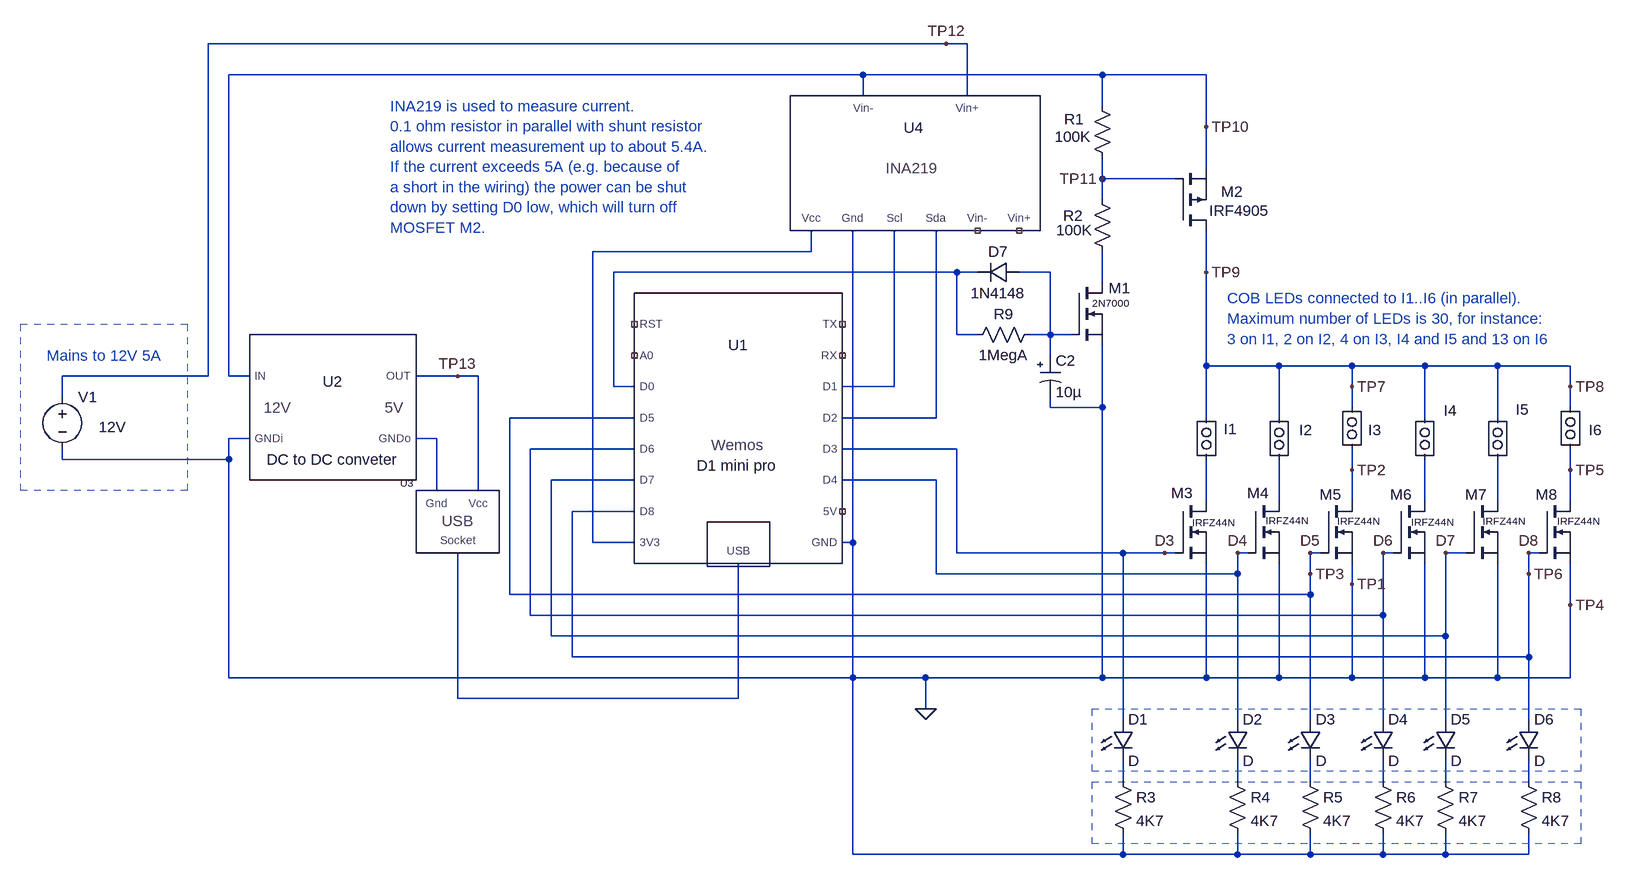
[diagram p0: schematic COBHouseLights.asc]
COBHouseLights.asc, the LTspice schematic file:
Version 4
SHEET 1 2516 680
WIRE 1216 -896 80 -896
WIRE 1248 -896 1216 -896
WIRE 1088 -848 112 -848
WIRE 1456 -848 1088 -848
WIRE 1616 -848 1456 -848
WIRE 1088 -816 1088 -848
WIRE 1248 -816 1248 -896
WIRE 1456 -800 1456 -848
WIRE 1616 -768 1616 -848
WIRE 1616 -704 1616 -768
WIRE 1456 -688 1456 -720
WIRE 1568 -688 1456 -688
WIRE 1456 -656 1456 -688
WIRE 1008 -576 1008 -608
WIRE 1008 -576 672 -576
WIRE 1232 -544 704 -544
WIRE 1264 -544 1232 -544
WIRE 1376 -544 1328 -544
WIRE 1616 -544 1616 -608
WIRE 1456 -528 1456 -576
WIRE 1232 -448 1232 -544
WIRE 1264 -448 1232 -448
WIRE 1376 -448 1376 -544
WIRE 1376 -448 1344 -448
WIRE 1408 -448 1376 -448
WIRE 1376 -416 1376 -448
WIRE 1616 -400 1616 -544
WIRE 1728 -400 1616 -400
WIRE 1840 -400 1728 -400
WIRE 1952 -400 1840 -400
WIRE 2064 -400 1952 -400
WIRE 2176 -400 2064 -400
WIRE 80 -384 80 -896
WIRE 80 -384 -144 -384
WIRE 112 -384 112 -848
WIRE 144 -384 112 -384
WIRE 464 -384 400 -384
WIRE 496 -384 464 -384
WIRE 704 -368 704 -544
WIRE 736 -368 704 -368
WIRE 1136 -368 1136 -608
WIRE 1136 -368 1056 -368
WIRE 1840 -368 1840 -400
WIRE 2176 -368 2176 -400
WIRE -144 -352 -144 -384
WIRE 1376 -336 1376 -352
WIRE 1456 -336 1456 -432
WIRE 1456 -336 1376 -336
WIRE 1840 -336 1840 -368
WIRE 2176 -336 2176 -368
WIRE 736 -320 544 -320
WIRE 1200 -320 1200 -608
WIRE 1200 -320 1056 -320
WIRE 1616 -320 1616 -400
WIRE 1728 -320 1728 -400
WIRE 1952 -320 1952 -400
WIRE 2064 -320 2064 -400
WIRE 144 -288 112 -288
WIRE 432 -288 400 -288
WIRE 736 -272 576 -272
WIRE 1232 -272 1056 -272
WIRE -144 -256 -144 -272
WIRE 112 -256 112 -288
WIRE 112 -256 -144 -256
WIRE 1840 -240 1840 -272
WIRE 2176 -240 2176 -272
WIRE 736 -224 608 -224
WIRE 1200 -224 1056 -224
WIRE 432 -208 432 -288
WIRE 496 -208 496 -384
WIRE 1616 -192 1616 -256
WIRE 1728 -192 1728 -256
WIRE 1840 -192 1840 -240
WIRE 1952 -192 1952 -256
WIRE 2064 -192 2064 -256
WIRE 2176 -192 2176 -240
WIRE 736 -176 640 -176
WIRE 672 -128 672 -576
WIRE 736 -128 672 -128
WIRE 1072 -128 1072 -608
WIRE 1072 -128 1056 -128
WIRE 1232 -112 1232 -272
WIRE 1488 -112 1232 -112
WIRE 1552 -112 1488 -112
WIRE 1568 -112 1552 -112
WIRE 1680 -112 1664 -112
WIRE 1792 -112 1776 -112
WIRE 1904 -112 1888 -112
WIRE 2016 -112 1984 -112
WIRE 2128 -112 2112 -112
WIRE 1200 -80 1200 -224
WIRE 1664 -80 1664 -112
WIRE 1664 -80 1200 -80
WIRE 1776 -80 1776 -112
WIRE 2112 -80 2112 -112
WIRE 1840 -64 1840 -96
WIRE 544 -48 544 -320
WIRE 1776 -48 1776 -80
WIRE 1776 -48 544 -48
WIRE 2176 -32 2176 -96
WIRE 576 -16 576 -272
WIRE 1888 -16 1888 -112
WIRE 1888 -16 576 -16
WIRE 608 16 608 -224
WIRE 1984 16 1984 -112
WIRE 1984 16 608 16
WIRE 640 48 640 -176
WIRE 2112 48 2112 -80
WIRE 2112 48 640 48
WIRE 112 80 112 -256
WIRE 1072 80 1072 -128
WIRE 1072 80 112 80
WIRE 1184 80 1072 80
WIRE 1456 80 1456 -336
WIRE 1456 80 1184 80
WIRE 1616 80 1616 -96
WIRE 1616 80 1456 80
WIRE 1728 80 1728 -96
WIRE 1728 80 1616 80
WIRE 1840 80 1840 -64
WIRE 1840 80 1728 80
WIRE 1952 80 1952 -96
WIRE 1952 80 1840 80
WIRE 2064 80 2064 -96
WIRE 2064 80 1952 80
WIRE 2176 80 2176 -32
WIRE 2176 80 2064 80
WIRE 464 112 464 -112
WIRE 896 112 896 -96
WIRE 896 112 464 112
WIRE 1184 128 1184 80
WIRE 1488 144 1488 -112
WIRE 1664 144 1664 -80
WIRE 1776 144 1776 -48
WIRE 1888 144 1888 -16
WIRE 1984 144 1984 16
WIRE 2112 144 2112 48
WIRE 1488 240 1488 208
WIRE 1664 240 1664 208
WIRE 1776 240 1776 208
WIRE 1888 240 1888 208
WIRE 1984 240 1984 208
WIRE 2112 240 2112 208
WIRE 1072 352 1072 80
WIRE 1488 352 1488 320
WIRE 1488 352 1072 352
WIRE 1664 352 1664 320
WIRE 1664 352 1488 352
WIRE 1776 352 1776 320
WIRE 1776 352 1664 352
WIRE 1888 352 1888 320
WIRE 1888 352 1776 352
WIRE 1984 352 1984 320
WIRE 1984 352 1888 352
WIRE 2112 352 2112 320
WIRE 2112 352 1984 352
FLAG 1552 -112 D3
FLAG 1664 -112 D4
FLAG 1776 -112 D5
FLAG 1888 -112 D6
FLAG 1984 -112 D7
FLAG 2112 -112 D8
FLAG 1840 -64 TP1
FLAG 2176 -32 TP4
FLAG 1840 -240 TP2
FLAG 1616 -544 TP9
FLAG 1616 -768 TP10
FLAG 2176 -240 TP5
FLAG 1776 -80 TP3
FLAG 2112 -80 TP6
FLAG 2176 -368 TP8
FLAG 1840 -368 TP7
FLAG 1456 -688 TP11
FLAG 1216 -896 TP12
FLAG 464 -384 TP13
FLAG 1184 128 0
SYMBOL Custom\\WemosD1-mini-pro 896 -336 R0
WINDOW 3 -2 89 Center 2
SYMATTR InstName U1
SYMBOL Custom\\DC-DC-Converter 272 -336 R0
SYMATTR InstName U2
SYMBOL Custom\\USB 464 -160 M0
SYMATTR InstName U3
SYMBOL voltage -144 -368 R0
WINDOW 3 56 62 Left 2
SYMATTR Value 12V
SYMATTR InstName V1
SYMBOL Custom\\INA219 1168 -736 R0
SYMATTR InstName U4
SYMBOL pmos 1568 -608 M180
WINDOW 0 71 60 Left 2
WINDOW 3 52 31 Left 2
SYMATTR InstName M2
SYMATTR Value IRF4905
SYMBOL nmos 1408 -528 R0
WINDOW 3 32 31 Left 1
WINDOW 0 58 8 Left 2
SYMATTR Value 2N7000
SYMATTR InstName M1
SYMBOL nmos 1568 -192 R0
WINDOW 0 -6 -12 Left 2
WINDOW 3 26 33 Left 1
SYMATTR InstName M3
SYMATTR Value IRFZ44N
SYMBOL nmos 1680 -192 R0
WINDOW 0 -1 -12 Left 2
WINDOW 3 27 30 Left 1
SYMATTR InstName M4
SYMATTR Value IRFZ44N
SYMBOL nmos 1792 -192 R0
WINDOW 0 -2 -10 Left 2
WINDOW 3 25 31 Left 1
SYMATTR InstName M5
SYMATTR Value IRFZ44N
SYMBOL nmos 1904 -192 R0
WINDOW 0 -5 -10 Left 2
WINDOW 3 27 32 Left 1
SYMATTR InstName M6
SYMATTR Value IRFZ44N
SYMBOL res 1440 -816 R0
WINDOW 0 -43 36 Left 2
WINDOW 3 -57 63 Left 2
SYMATTR InstName R1
SYMATTR Value 100K
SYMBOL Custom\\Connector 1600 -320 R0
WINDOW 0 43 17 Left 2
SYMATTR InstName I1
SYMBOL Custom\\Connector 1712 -320 R0
WINDOW 0 47 19 Left 2
SYMATTR InstName I2
SYMBOL Custom\\Connector 1824 -336 R0
WINDOW 0 41 35 Left 2
SYMATTR InstName I3
SYMBOL Custom\\Connector 1936 -320 R0
WINDOW 0 45 -11 Left 2
SYMATTR InstName I4
SYMBOL nmos 2016 -192 R0
WINDOW 0 -2 -10 Left 2
WINDOW 3 25 31 Left 1
SYMATTR InstName M7
SYMATTR Value IRFZ44N
SYMBOL nmos 2128 -192 R0
WINDOW 0 -5 -10 Left 2
WINDOW 3 28 31 Left 1
SYMATTR InstName M8
SYMATTR Value IRFZ44N
SYMBOL Custom\\Connector 2048 -320 R0
WINDOW 0 44 -13 Left 2
SYMATTR InstName I5
SYMBOL Custom\\Connector 2160 -336 R0
WINDOW 0 44 35 Left 2
SYMATTR InstName I6
SYMBOL res 1440 -672 R0
WINDOW 0 -44 41 Left 2
WINDOW 3 -55 63 Left 2
SYMATTR InstName R2
SYMATTR Value 100K
SYMBOL res 1472 224 R0
SYMATTR InstName R3
SYMATTR Value 4K7
SYMBOL LED 1472 144 R0
SYMATTR InstName D1
SYMBOL res 1648 224 R0
SYMATTR InstName R4
SYMATTR Value 4K7
SYMBOL LED 1648 144 R0
SYMATTR InstName D2
SYMBOL res 1760 224 R0
SYMATTR InstName R5
SYMATTR Value 4K7
SYMBOL LED 1760 144 R0
SYMATTR InstName D3
SYMBOL res 1872 224 R0
SYMATTR InstName R6
SYMATTR Value 4K7
SYMBOL LED 1872 144 R0
SYMATTR InstName D4
SYMBOL res 1968 224 R0
SYMATTR InstName R7
SYMATTR Value 4K7
SYMBOL LED 1968 144 R0
SYMATTR InstName D5
SYMBOL res 2096 224 R0
SYMATTR InstName R8
SYMATTR Value 4K7
SYMBOL LED 2096 144 R0
SYMATTR InstName D6
SYMBOL polcap 1360 -416 R0
WINDOW 3 24 56 Left 2
SYMATTR InstName C2
SYMATTR Value 10µ
SYMATTR Description Capacitor
SYMATTR Type cap
SYMATTR SpiceLine V=25 Irms=50m Rser=1.746 Lser=83.1619n mfg="Würth Elektronik" pn="860010472002 WCAP-ATG8 5x11" type="Al electrolytic"
SYMBOL res 1360 -464 R90
WINDOW 0 0 56 VBottom 2
WINDOW 3 32 56 VTop 2
SYMATTR InstName R9
SYMATTR Value 1MegA
SYMBOL diode 1328 -560 R90
WINDOW 0 0 32 VBottom 2
WINDOW 3 32 32 VTop 2
SYMATTR InstName D7
SYMATTR Value 1N4148
TEXT -168 -416 Left 2 ;Mains to 12V 5A
TEXT 1648 -504 Left 2 ;COB LEDs connected to I1..I6 (in parallel).\nMaximum number of LEDs is 30, for instance:\n3 on I1, 2 on I2, 4 on I3, I4 and I5 and 13 on I6
TEXT 360 -800 Left 2 ;INA219 is used to measure current.\n0.1 ohm resistor in parallel with shunt resistor\nallows current measurement up to about 5.4A.\nIf the current exceeds 5A (e.g. because of\na short in the wiring) the power can be shut\ndown by setting D0 low, which will turn off\nMOSFET M2.
RECTANGLE Normal 48 -208 -208 -464 2
RECTANGLE Normal 2192 224 1440 128 2
RECTANGLE Normal 2192 336 1440 240 2

The netlist it stands for:
* COBHouseLights.asc
XU1 N002 NC_01 D4 NC_02 N005 N006 D3 0 N012 D7 TP6 TP3 NC_03 D6 NC_04 NC_05 N001 LTC3217  ; pins D0 TX D4 RX D1 D2 D3 GND USB D7 D8 D5 5V D6 RST A0 3V3
XU2 TP13 TP10 0 N007 LTC4357  ; pins OUT IN GNDi GNDo
XU3 TP13 N007 N012 USB  ; pins Vcc Gnd Socket
V1 TP12 0 12V
XU4 N001 0 N005 N006 NC_06 NC_07 TP10 TP12 INA219  ; pins Vcc Gnd Scl Sda Vin- Vin+ Vin- Vin+
M2 TP7 TP11 TP10 TP10 IRF4905
M1 N004 N003 0 0 2N7000
M3 N008 D3 0 0 IRFZ44N
M4 N009 D4 0 0 IRFZ44N
M5 TP2 TP3 0 0 IRFZ44N
M6 N010 D6 0 0 IRFZ44N
R1 TP10 TP11 100K
I1 TP7 N008
I2 TP7 N009
I3 TP7 TP2
I4 TP7 N010
M7 N011 D7 0 0 IRFZ44N
M8 TP5 TP6 0 0 IRFZ44N
I5 TP7 N011
I6 TP7 TP5
R2 TP11 N004 100K
R3 N013 0 4K7
D1 D3 N013 D
R4 N014 0 4K7
D2 D4 N014 D
R5 N015 0 4K7
D3 TP3 N015 D
R6 N016 0 4K7
D4 D6 N016 D
R7 N017 0 4K7
D5 D7 N017 D
R8 N018 0 4K7
D6 TP6 N018 D
C2 N003 0 10µ V=25 Irms=50m Rser=1.746 Lser=83.1619n mfg="Würth Elektronik" pn="860010472002 WCAP-ATG8 5x11" type="Al electrolytic"
R9 N003 N002 1MegA
D7 N003 N002 1N4148
.model D D
.lib standard.dio
.model NMOS NMOS
.model PMOS PMOS
.lib standard.mos
* Mains to 12V 5A
* COB LEDs connected to I1..I6 (in parallel).
* Maximum number of LEDs is 30, for instance:
* 3 on I1, 2 on I2, 4 on I3, I4 and I5 and 13 on I6
* INA219 is used to measure current.
* 0.1 ohm resistor in parallel with shunt resistor
* allows current measurement up to about 5.4A.
* If the current exceeds 5A (e.g. because of
* a short in the wiring) the power can be shut
* down by setting D0 low, which will turn off
* MOSFET M2.
.lib LTC3217.sub
.lib LTC4357.sub
.backanno
.end